# EasyEDA Pro project TC264D主板1.0.eprj, board PCB1
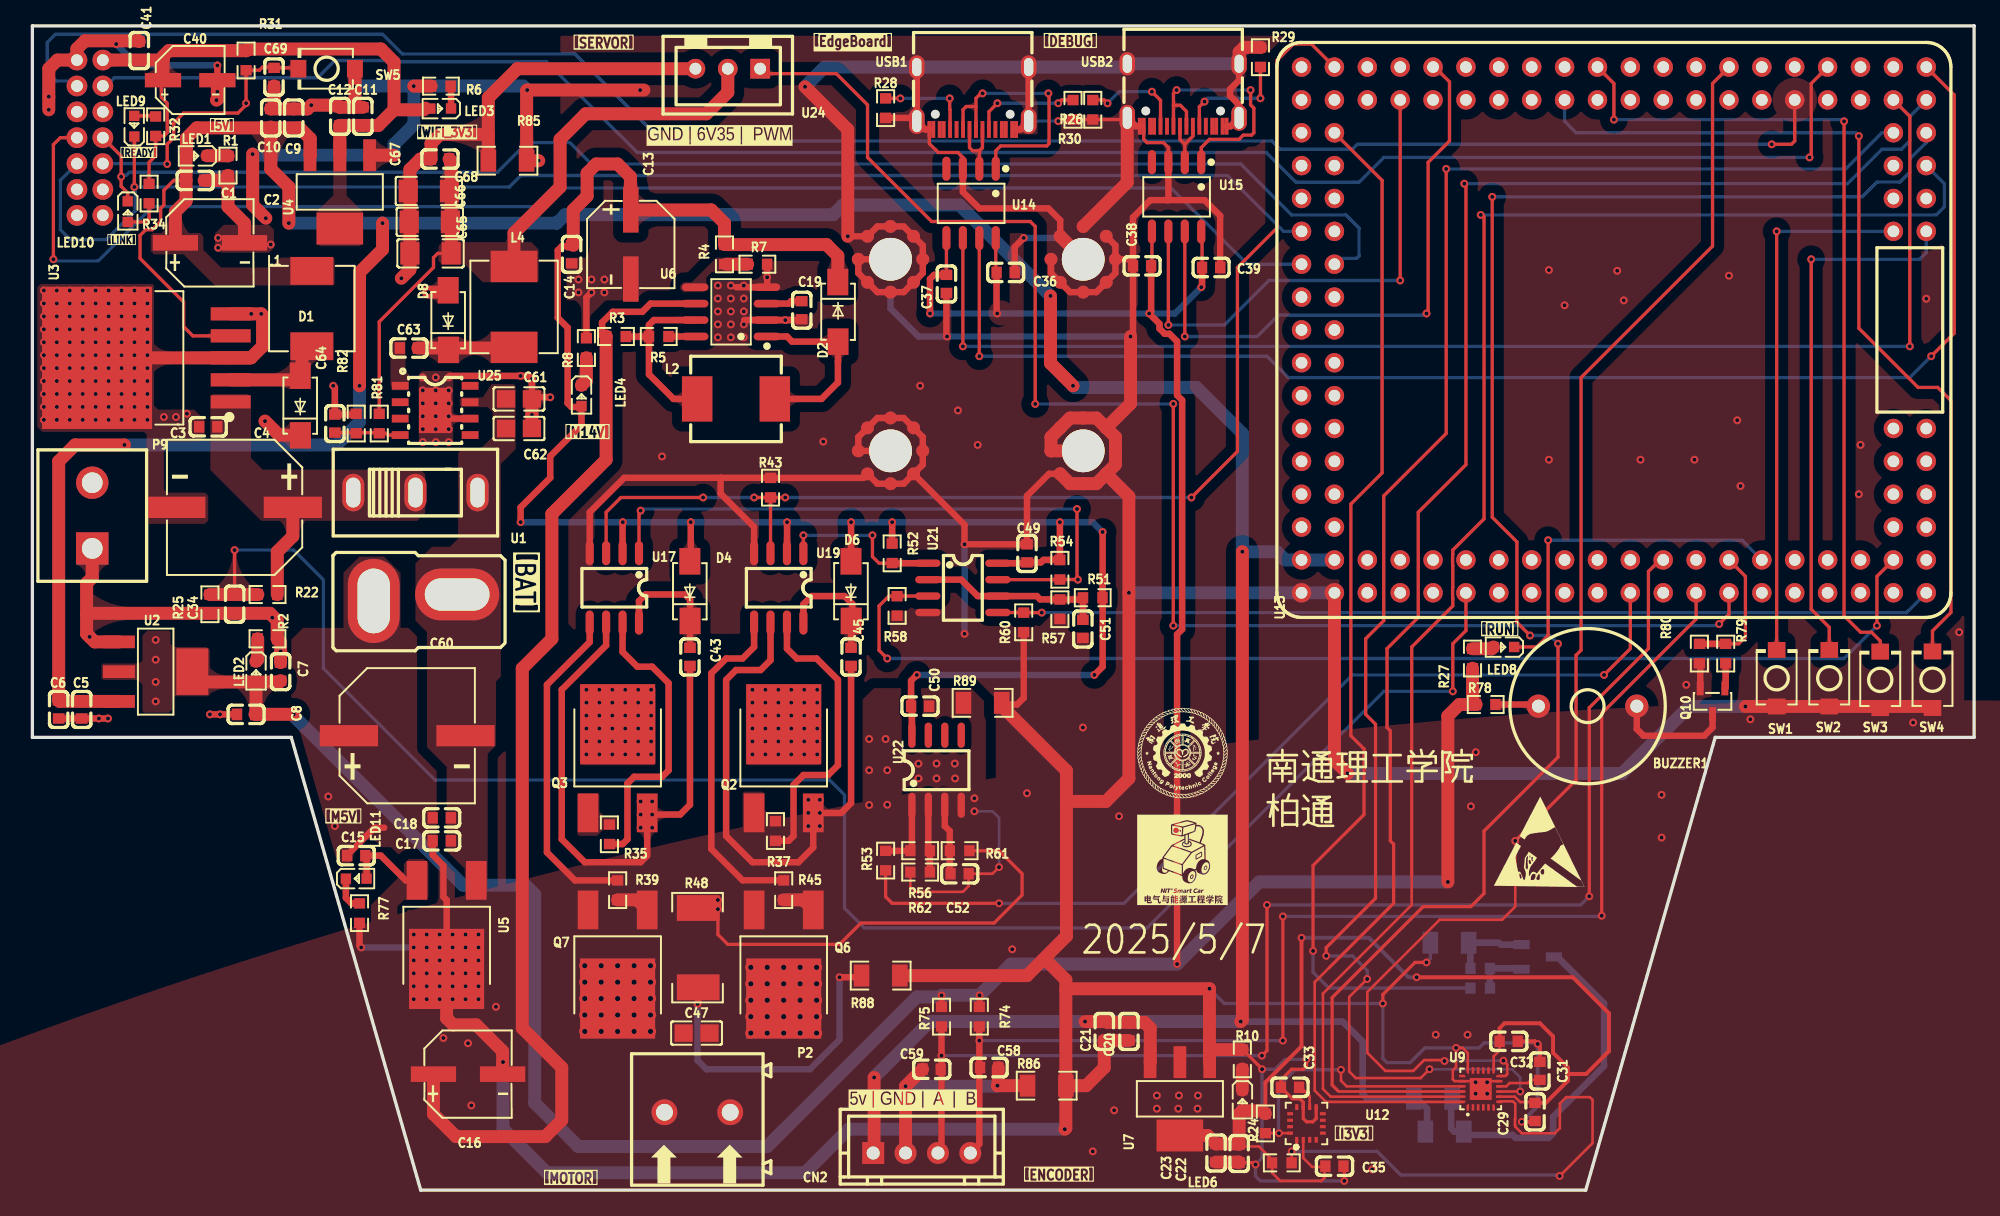
[diagram p3: board, top side]
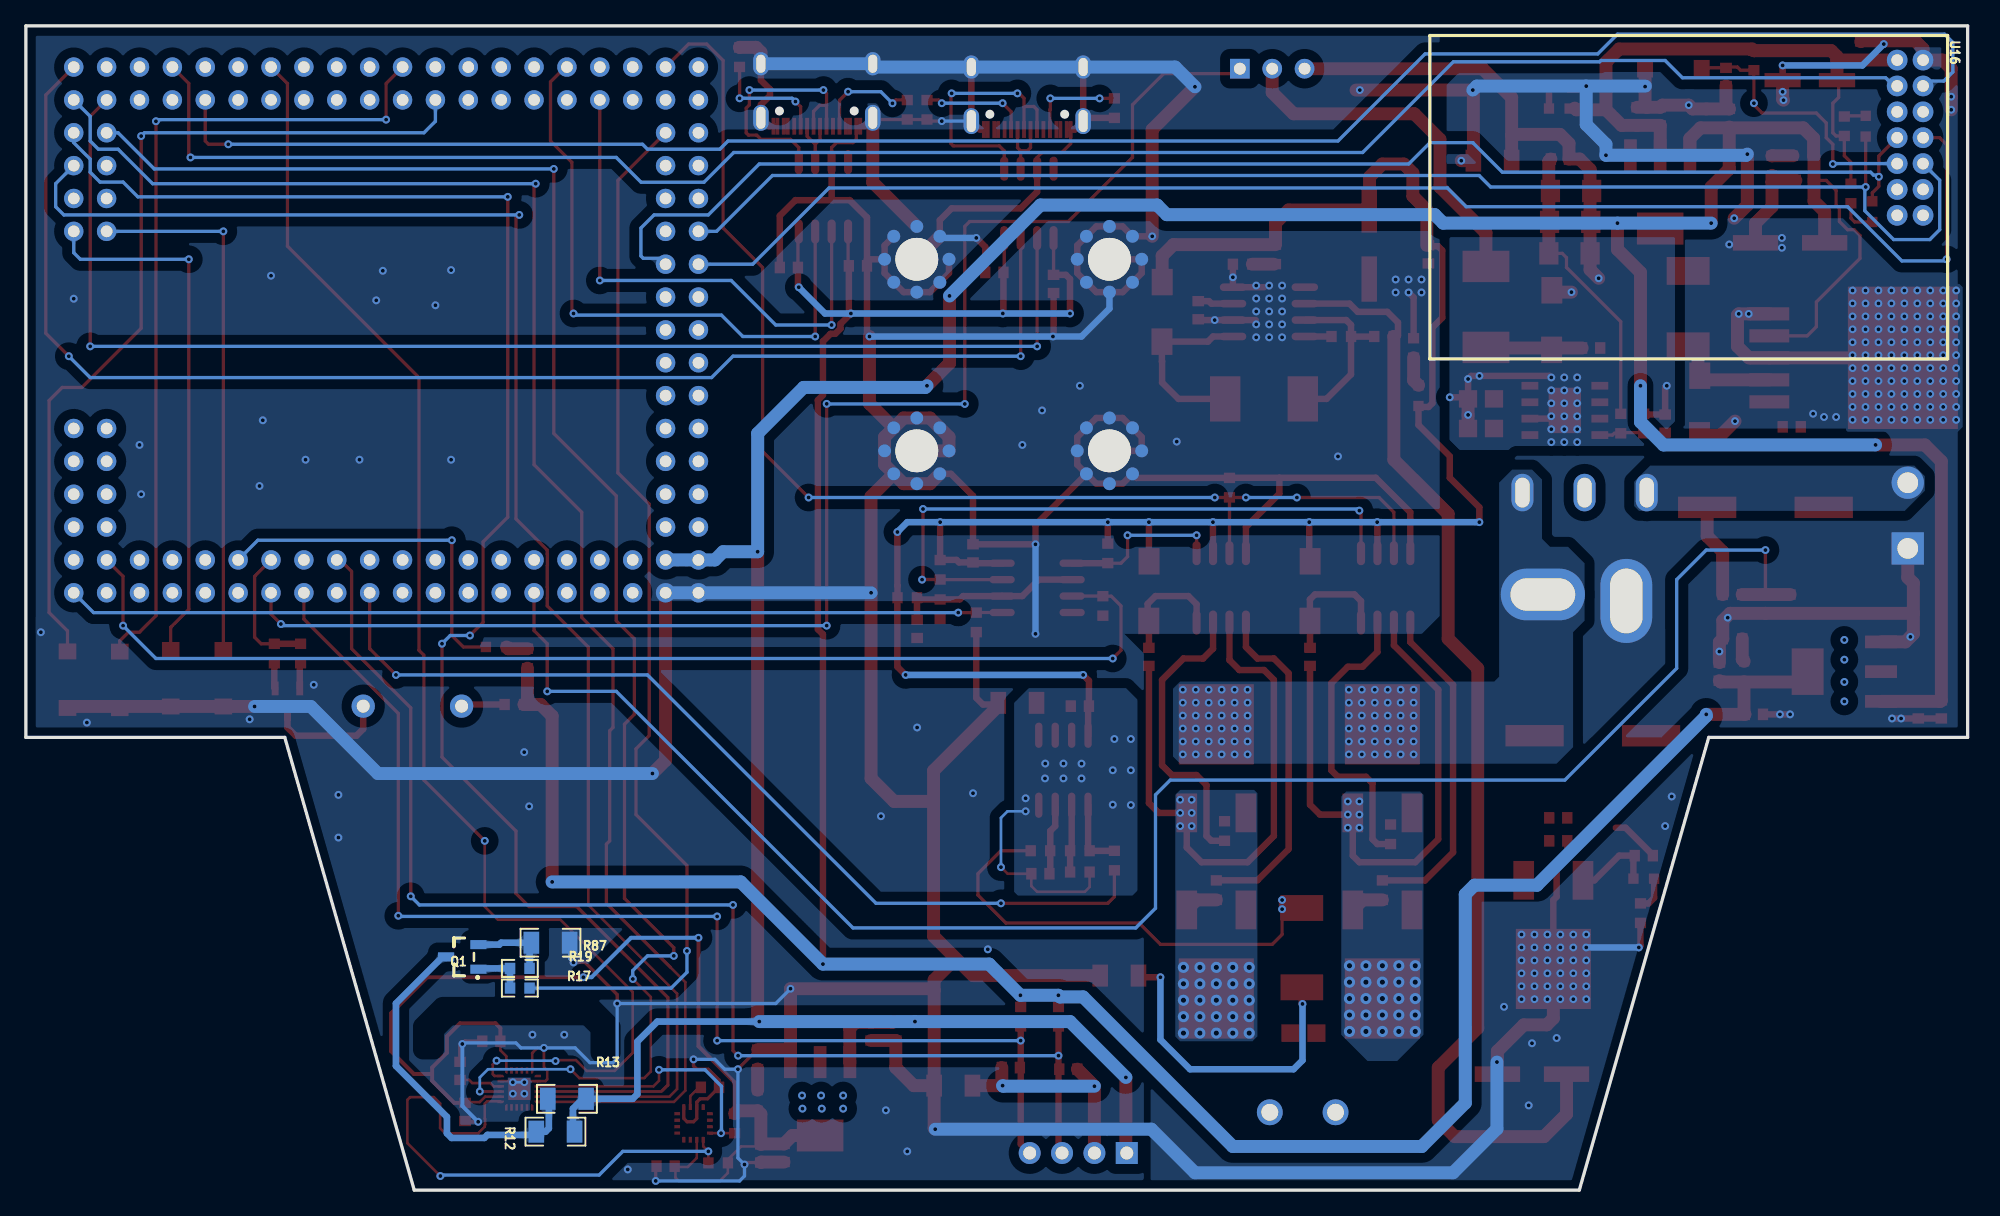
[diagram p4: board, bottom side, seen from below]

Outline 150 x 90 mm; copper layers: Top Layer, Bottom Layer. Coordinates in mm from the lower left corner of the outline.
Outline path: 0,90 0,35 20,35 30,0 120,0 130,35 150,35 150,90 0,90
Stack: Top Layer 0.035mm / Dielectric1 1.51mm FR4 er 4.5 / Bottom Layer 0.035mm

## Design rules (mm)
template: 自定义配置
spacing copperThickness1oz (default): track to track 0.102, other pairs 0.127 to 0.3
spacing copperThickness2oz: track to track 0.203, other pairs 0.152 to 0.3
track width copperThickness1oz (default): min 0.127, default 0.254, max 2.54
track width copperThickness2oz: min 0.203, default 0.254, max 2.54
differential pair differentialPair (default): width min 0.127, default 0.254, max 2.54; gap min 0.152, default 0.152
via viaSize (default): diameter min 0.5, default 0.61, max 10; hole min 0.3, default 0.305, max 6.299
net GND uses copperRegion2
net 14V uses copperRegion1
net AGND uses copperRegion1
net VCC_BAT uses copperRegion1
net SERVOR_GND uses copperRegion1

## Placement (name value [footprint] x y rotation side)
BUZZER1  2.3kHz  [BUZ-TH_BD12.0-P7.60-D0.6-FD]  120.14 37.41 0 top
C1  100nF  [C0603]  12.57 78.05 180 top
C2  220uF  [CAP-SMD_BD6.3-L6.6-W6.6-FD]  13.72 73.23 0 top
C3  100nF  [C0603]  13.59 59 0 top
C4  680uF  [CAP-SMD_BD10.0-L10.3-W10.3-LS10.9-FD]  15.62 52.78 180 top
C5  0.1u  [C0603]  3.81 37.16 90 top
C6  100uF  [C0603]  2.03 37.16 90 top
C7  0.1u  [C0603]  19.18 40.08 270 top
C8  100uF  [C0603]  16.51 36.78 0 top
C9  0.1u  [C0603]  20.19 82.88 270 top
C10  100uF  [C0603]  18.42 82.88 270 top
C11  0.1u  [C0603]  25.53 83.01 270 top
C12  100uF  [C0603]  23.75 83.01 270 top
C13  220uF/25V  [CAP-SMD_BD6.3-L6.6-W6.6-LS7.8-FD]  46.23 73.1 270 top
C14  0.1uf  [C0603]  41.66 72.34 90 top
C15  0.1uf  [C0603]  25.02 25.86 0 top
C16  220uF/25V  [CAP-SMD_BD6.3-L6.6-W6.6-LS7.8-FD]  33.66 8.97 0 top
C17  0.1uf  [C0603]  31.62 27 0 top
C18  10uf  [C0603]  31.62 28.78 0 top
C19  1nf  [C0603]  59.44 68.02 90 top
C20  0.1u  [C0603]  84.71 12.27 90 top
C21  100uF  [C0603]  82.8 12.27 90 top
C22  0.1u  [C0603]  93.22 2.83 90 top
C23  100uF  [C0603]  91.44 2.87 90 top
C29  10nf  [C0603]  116.08 6.04 270 top
C31  0.1uf  [C0603]  116.46 9.22 90 top
C32  0.1uf  [C0603]  114.05 11.5 180 top
C33  0.1uf  [C0603]  97.16 7.95 0 top
C34  0.1uf  [C0603]  15.62 45.29 270 top
C35  0.1uf  [C0603]  100.58 1.85 180 top
C36  0.1uF  [C0603]  75.18 70.94 180 top
C37  0.1uF  [C0603]  70.61 70.05 90 top
C38  0.1uF  [C0603]  85.72 71.45 0 top
C39  0.1uF  [C0603]  91.06 71.32 180 top
C40  100uF  [CAP-SMD_BD5.0-L5.3-W5.3-FD]  12.19 85.8 0 top
C41  10uf  [C0603]  8.25 88.09 270 top
C43  1NF  [C0603]  50.8 41.22 90 top
C45  1NF  [C0603]  63.25 41.22 90 top
C47  0.1uf  [C0805]  51.31 12.14 0 top
C49  0.1uf  [C0603]  76.84 49.22 90 top
C50  0.1uf  [C0603]  68.58 37.41 0 top
C51  0.1uf  [C0603]  81.15 43.38 90 top
C52  0.1uf  [C0603]  71.63 24.46 180 top
C58  68pf  [C0603]  73.91 9.47 0 top
C59  68pf  [C0603]  69.47 9.35 180 top
C60  220uF  [CAP-SMD_BD10.0-L10.3-W10.3-LS11.3-FD]  28.96 35.13 0 top
C61  10uF  [C0805]  37.59 61.16 180 top
C62  10uF  [C0805]  37.59 58.88 180 top
C63  100nF  [C0603]  29.08 65.1 180 top
C64  470pF  [C0603]  23.37 59.26 270 top
C65  47uF  [C1206]  30.76 72.41 0 top
C66  47uF  [C1206]  30.7 74.85 0 top
C67  47uF  [C1206]  30.63 77.24 0 top
C68  100nF  [C0603]  31.5 79.7 0 top
C69  100nF  [C0603]  18.67 86.05 90 top
CN1  AM-1015B-F  [CONN-TH_AM-1015B-F]  29.59 45.8 270 top
CN2  XH-4A  [CONN-TH_4P-P2.50_XH-4A]  68.71 2.87 0 top
CON1  -  [CON_M3*0.3]  66.29 71.96 0 top
CON2  -  [CON_M3*0.3]  81.18 57.15 0 top
CON3  -  [CON_M3*0.3]  81.18 71.96 0 top
CON4  -  [CON_M3*0.3]  66.29 57.15 0 top
D1  SS34  [SMA_L4.3-W2.6-LS5.0-FD]  20.7 60.65 270 top
D2  SS54  [SMA_L4.3-W2.6-LS5.0-FD]  62.23 67.89 90 top
D4  SS54  [SMA_L4.3-W2.6-LS5.0-FD]  50.8 46.3 270 top
D6  SS54  [SMA_L4.3-W2.6-LS5.0-FD]  63.25 46.3 270 top
D8  SS34  [SMA_L4.3-W2.6-LS5.0-FD]  32.13 67.26 270 top
L1  33uH  [IND-SMD_L7.1-W6.6]  21.59 68.15 270 top
L2  47uH  [IND-SMD_L7.3-W6.8]  54.36 61.16 0 top
L4  15uH  [IND-SMD_L7.0-W6.6_FXL0630]  37.21 68.27 90 top
LED1  NCD0603R1  [LED0603-RD_RED]  12.7 79.96 180 top
LED2  NCD0603R1  [LED0603-RD_RED]  17.27 40.08 270 top
LED3  NCD0603R1  [LED0603-RD_RED]  31.54 83.61 180 top
LED4  NCD0603R1  [LED0603-RD_RED]  42.42 61.42 270 top
LED6  NCD0603R1  [LED0603-RD_RED]  93.47 6.93 270 top
LED8  NCD0603R1  [LED0603-RD_RED]  113.66 41.99 180 top
LED9  NCD0603R1  [LED0603-RD_RED]  7.87 82.24 90 top
LED10  NCD0603R1  [LED0603-RD_RED]  7.37 75.64 270 top
LED11  NCD0603R1  [LED0603-RD_RED]  25.02 24.08 0 top
P2  WJ500V-5.08-2P  [CONN-TH_2P-P5.00_WJ500V-5.08-2P]  51.37 6.02 180 top
P9  XY2500V-C-5.08-2P  [CONN-TH_XY2500V-C-5.08-2P]  4.83 52.15 90 top
Q1  PMV31XN-VB  [SOT-23-3_L2.9-W1.5-P1.90-LS2.6-BR]  116.29 18.03 180 bottom
Q2  IRLR8726  [TO-252-2_L6.6-W6.1-P4.57-LS10.1-BR-CW]  58.04 32.59 270 top
Q3  IRLR8726  [TO-252-2_L6.6-W6.1-P4.57-LS10.1-BR-CW]  45.21 32.59 270 top
Q6  IRLR8726  [TO-252-2_L6.6-W6.1-P4.57-LS10.1-BR-CW]  58.04 18.24 90 top
Q7  IRLR8726  [TO-252-2_L6.6-W6.1-P4.57-LS10.1-BR-CW]  45.21 18.24 90 top
Q10  S8050  [SOT-23-3_L2.9-W1.3-P1.90-LS2.3-BR]  129.79 37.79 90 top
R1  1k  [R0603]  15.11 79.2 90 top
R2  510Ω  [R0603]  18.16 42.62 180 top
R3  1R  [R0603]  45.08 65.99 180 top
R4  12K  [R0603]  53.47 72.34 90 top
R5  200R  [R0603]  48.39 65.99 0 top
R6  510Ω  [R0603]  31.56 85.34 0 top
R7  1K  [R0603]  56.01 71.58 180 top
R8  1.5K  [R0603]  42.8 65.1 270 top
R10  510Ω  [R0603]  93.47 10.11 270 top
R12  22Ω  [R1206]  109.09 4.52 180 bottom
R13  22Ω  [R1206]  108.2 7.06 180 bottom
R17  100R  [R0603]  111.84 15.62 0 bottom
R19  10K  [R0603]  111.84 17.14 0 bottom
R22  10K  [R0603]  18.17 46.04 0 top
R23  4.7K  [R0603]  96.52 2.11 0 top
R24  4.7K  [R0603]  95.25 5.16 270 top
R25  1K  [R0603]  13.72 45.29 90 top
R26  5.1K  [R0603]  80.39 83.51 270 top
R27  510Ω  [R0603]  111.25 41.1 270 top
R28  5.1K  [R0603]  65.91 83.64 270 top
R29  5.1K  [R0603]  94.87 87.58 90 top
R30  5.1K  [R0603]  81.91 83.51 270 top
R31  4.7K  [R0603]  16.51 87.32 270 top
R32  1K  [R0603]  9.53 82.24 270 top
R34  1K  [R0603]  9.02 77.04 90 top
R35  220R  [R0603]  44.58 27.51 270 top
R37  220R  [R0603]  57.4 27.76 90 top
R39  220R  [R0603]  45.21 23.19 90 top
R43  30K  [R0603]  57.02 54.3 270 top
R45  220R  [R0603]  58.04 23.19 270 top
R48  4mΩ  [RES-SMD_L6.4-W3.2-R2512]  51.44 18.74 90 top
R51  75K  [R0603]  81.91 45.8 0 top
R52  10K  [R0603]  66.42 49.22 90 top
R53  10K  [R0603]  65.91 25.48 270 top
R54  10K  [R0603]  79.38 47.95 90 top
R56  30K  [R0603]  68.58 26.24 180 top
R57  10K  [R0603]  79.38 44.91 90 top
R58  10K  [R0603]  66.8 45.16 90 top
R60  10K  [R0603]  76.58 43.89 90 top
R61  10K  [R0603]  71.63 26.24 180 top
R62  1K  [R0603]  68.58 24.59 180 top
R74  10k  [R0603]  73.15 13.41 90 top
R75  10k  [R0603]  70.23 13.41 90 top
R77  1k  [R0603]  25.27 21.41 90 top
R78  10R  [R0603]  112.27 37.54 0 top
R79  4.7K  [R0603]  130.81 41.48 270 top
R80  10K  [R0603]  128.78 41.48 270 top
R81  42K  [R0603]  26.8 59.26 90 top
R82  10K  [R0603]  25.02 59.26 270 top
R85  0Ω  [R1206]  36.7 79.58 0 top
R86  0Ω  [R1206]  78.36 8.08 0 top
R87  0Ω  [R1206]  109.47 19.12 0 bottom
R88  0Ω  [R1206]  65.53 16.59 0 top
R89  0Ω  [R1206]  73.41 37.67 0 top
SW1  TS-1088-AR02016  [SW-SMD_L3.9-W3.0-P4.45]  134.75 39.57 90 top
SW2  TS-1088-AR02016  [SW-SMD_L3.9-W3.0-P4.45]  138.81 39.57 90 top
SW3  TS-1088-AR02016  [SW-SMD_L3.9-W3.0-P4.45]  142.75 39.45 90 top
SW4  TS-1088-AR02016  [SW-SMD_L3.9-W3.0-P4.45]  146.78 39.46 90 top
SW5  TS-1088-AR02016  [SW-SMD_L3.9-W3.0-P4.45]  22.73 86.69 180 top
U1  SS12D10G5  [SW-TH_SHOU-HAN_SS12D10G4]  29.59 53.92 0 top
U2  AMS1117-3.3  [SOT-223-4_L6.5-W3.5-P2.30-LS7.0-BR]  9.53 40.08 180 top
U3  LM2596S-5.0  [TO-263-5_L10.2-W8.9-P1.70-BR]  10.16 64.34 0 top
U4  AMS1117-3.3  [SOT-223-4_L6.5-W3.5-P2.30-LS7.0-BR]  23.75 77.16 90 top
U5  78M05  [TO-252-2_L6.6-W6.1-P4.57-LS9.9-BR-CW]  32 20.52 90 top
U6  MC34063ADR  [SOIC-8_L4.9-W3.9-P1.27-LS6.0-BL]  53.97 67.89 90 top
U7  AMS1117-3.3  [SOT-223-4_L6.5-W3.5-P2.30-LS7.0-BR]  88.65 7.06 90 top
U9  MPU-6500  [QFN-24_L3.0-W3.0-P0.40-BL-EP]  111.89 7.82 0 top
U12  QMC5883P  [LGA-16_L3.0-W3.0-P0.50-BL_SQ]  98.43 5.16 0 top
U13  -  [逐飞核心板]  121.16 66.88 90 top
U14  CH340N  [SOP-8_L4.9-W3.9-P1.27-LS6.0-BL]  72.52 76.28 180 top
U15  CH340N  [SOP-8_L4.9-W3.9-P1.27-LS6.0-BL]  88.39 76.78 180 top
U16  USR-WIFI232-B2  [COMM-TH_USR-WIFI232-B2]  4.44 81.36 0 bottom
U17  L6384ED013TR  [SOP-8_L4.9-W3.9-P1.27-LS6.0-BL]  44.96 46.56 180 top
U19  L6384ED013TR  [SOP-8_L4.9-W3.9-P1.27-LS6.0-BL]  57.66 46.56 180 top
U21  LM393DR  [SOIC-8_L5.0-W4.0-P1.27-LS6.0-BL]  71.88 46.56 270 top
U22  LM258DR  [SOIC-8_L5.0-W4.0-P1.27-LS6.0-BL]  69.85 32.46 0 top
U24  BX-XH2.54-3PZZ  [CONN-TH_3P-P2.50_BX-XH2.54-3PZZ]  53.72 86.69 180 top
U25  TPS5430DDAR  [ESOP-8_L4.9-W3.9-P1.27-LS6.0-TL-EP]  31.11 60.27 0 top
USB1  KH-TYPE-C-16P  [USB-C-SMD_KH-TYPE-C-16P]  72.64 84.4 180 top
USB2  KH-TYPE-C-16P  [USB-C-SMD_KH-TYPE-C-16P]  88.9 84.66 180 top

## Footprints (pads in the part's own frame, mm; a bottom-side part is the same pattern mirrored in y, then rotated)
BUZ-TH_BD12.0-P7.60-D0.6-FD
  round 1.8 hole 1: 1(-3.8,0) 2(3.8,0)
C0603
  rect 0.8x0.9 smd: 1(-0.7,0) 2(0.7,0)
C0805
  rect 1.41x1.35 smd: 1(-1,0) 2(1,0)
C1206
  rect 1.485x1.728 smd: 1(-1.593,0) 2(1.593,0)
CAP-SMD_BD5.0-L5.3-W5.3-FD
  rect 2.8x1.1 smd: 1(-2.1,0) 2(2.1,0)
CAP-SMD_BD6.3-L6.6-W6.6-FD
  rect 3.5x1.2 smd: 1(-2.67,0) 2(2.67,0)
CAP-SMD_BD6.3-L6.6-W6.6-LS7.8-FD
  rect 3.5x1.2 smd: 1(-2.67,0) 2(2.67,0)
CAP-SMD_BD10.0-L10.3-W10.3-LS10.9-FD
  rect 4.5x1.65 smd: 1(-4.5,0) 2(4.5,0)
CAP-SMD_BD10.0-L10.3-W10.3-LS11.3-FD
  rect 4.5x1.65 smd: 1(-4.5,0) 2(4.5,0)
COMM-TH_USR-WIFI232-B2
  round 1.6 hole 0.9: 1(-1,-6) 2(1,-6) 3(-1,-4) 4(1,-4) 5(-1,-2) 6(1,-2) 7(-1,0) 8(1,0) 9(-1,2) 10(1,2) 11(-1,4) 12(1,4) 13(-1,6) 14(1,6)
CON_M3*0.3
  round 1 hole 0.003: 1(-2.489,0) 1(-1.778,1.778) 1(-1.778,-1.778) 1(0,2.54) 1(0,-2.54) 1(1.778,1.778) 1(1.778,-1.778) 1(2.489,0)
  round 3.3 hole 3.3: 1(0,0)
CONN-TH_2P-P5.00_WJ500V-5.08-2P
  round 2 hole 1.3: 1(-2.54,0) 2(2.54,0)
CONN-TH_3P-P2.50_BX-XH2.54-3PZZ
  rect 1.524x1.524 hole 0.914: 1(-2.5,0)
  round 1.524 hole 0.914: 2(0,0) 3(2.5,0)
CONN-TH_4P-P2.50_XH-4A
  rect 1.7x1.7 hole 1: 1(-3.751,0)
  round 1.7 hole 1: 2(-1.25,0) 3(1.25,0) 4(3.751,0)
CONN-TH_AM-1015B-F
  oval 4x6.5 hole 2.5x5: 1(-0.25,3.224)
  oval 6.5x4 hole 5x2.5: 2(0.25,-3.224)
CONN-TH_XY2500V-C-5.08-2P
  rect 2.5x2.5 hole 1.6: 1(-2.54,0.2)
  round 2.5 hole 1.6: 2(2.54,0.2)
ESOP-8_L4.9-W3.9-P1.27-LS6.0-TL-EP
  rect 1.3x0.6 smd: 1(-2.7,1.905) 2(-2.7,0.635) 3(-2.7,-0.635) 4(-2.7,-1.905) 5(2.7,-1.905) 6(2.7,-0.635) 7(2.7,0.635) 8(2.7,1.905)
  rect 2.5x3.5 smd: 9(0,0)
IND-SMD_L7.0-W6.6_FXL0630
  rect 2.424x3.62 smd: 1(3.128,0) 2(-3.128,0)
IND-SMD_L7.1-W6.6
  rect 2.15x3.32 smd: 1(-2.913,0) 2(2.913,0)
IND-SMD_L7.3-W6.8
  rect 2.35x3.5 smd: 1(-3,0) 2(3,0)
LED0603-RD_RED
  rect 0.8x0.8 smd: 1(-0.799,-0.004) 2(0.799,0.004)
LGA-16_L3.0-W3.0-P0.50-BL_SQ
  rect 0.25x0.45 smd: 1(-0.75,-1.263) 2(-0.25,-1.263) 3(0.25,-1.263) 4(0.75,-1.263) 9(0.75,1.263) 10(0.25,1.263) 11(-0.25,1.263) 12(-0.75,1.263)
  rect 0.45x0.25 smd: 5(1.263,-0.75) 6(1.263,-0.25) 7(1.263,0.25) 8(1.263,0.75) 13(-1.263,0.75) 14(-1.263,0.25) 15(-1.263,-0.25) 16(-1.263,-0.75)
QFN-24_L3.0-W3.0-P0.40-BL-EP
  custom 0.2x0.506 smd: 1(-1,-1.427) 6(1,-1.427) 13(1,1.427) 18(-1,1.427)
  rect 0.2x0.505 smd: 2(-0.6,-1.427) 3(-0.2,-1.427) 4(0.2,-1.427) 5(0.6,-1.427) 14(0.6,1.427) 15(0.2,1.427) 16(-0.2,1.427) 17(-0.6,1.427)
  custom 0.506x0.2 smd: 7(1.427,-1) 12(1.427,1) 19(-1.427,1) 24(-1.427,-1)
  rect 0.505x0.2 smd: 8(1.427,-0.6) 9(1.427,-0.2) 10(1.427,0.2) 11(1.427,0.6) 20(-1.427,0.6) 21(-1.427,0.2) 22(-1.427,-0.2) 23(-1.427,-0.6)
  rect 1.7x1.7 smd: 25(0,0)
R0603
  rect 0.806x0.864 smd: 1(-0.753,0) 2(0.753,0)
R1206
  rect 1.208x1.701 smd: 1(-1.479,0) 2(1.479,0)
RES-SMD_L6.4-W3.2-R2512
  rect 2x3.3 smd: 1(-3.067,0) 2(3.067,0)
SMA_L4.3-W2.6-LS5.0-FD
  rect 2.046x1.62 smd: 1(-2.304,-0.009) 2(2.304,0.009)
SOIC-8_L4.9-W3.9-P1.27-LS6.0-BL
  oval 0.588x2.045 smd: 1(-1.905,-2.772) 2(-0.635,-2.772) 3(0.635,-2.772) 4(1.905,-2.772) 5(1.905,2.772) 6(0.635,2.772) 7(-0.635,2.772) 8(-1.905,2.772)
SOIC-8_L5.0-W4.0-P1.27-LS6.0-BL
  oval 0.569x1.95 smd: 1(-1.905,-2.705) 2(-0.635,-2.705) 3(0.635,-2.705) 4(1.905,-2.705) 5(1.905,2.705) 6(0.635,2.705) 7(-0.635,2.705) 8(-1.905,2.705)
SOP-8_L4.9-W3.9-P1.27-LS6.0-BL
  oval 0.63x1.865 smd: 1(-1.905,-2.683) 2(-0.635,-2.683) 3(0.635,-2.683) 4(1.905,-2.683) 5(1.905,2.683) 6(0.635,2.683) 7(-0.635,2.683) 8(-1.905,2.683)
SOT-23-3_L2.9-W1.3-P1.90-LS2.3-BR
  rect 1.07x0.532 smd: 1(0.99,-0.95) 2(0.99,0.95) 3(-0.99,0)
SOT-23-3_L2.9-W1.5-P1.90-LS2.6-BR
  rect 1.25x0.7 smd: 1(1.25,-0.95) 2(1.25,0.95) 3(-1.25,0)
SOT-223-4_L6.5-W3.5-P2.30-LS7.0-BR
  rect 2.47x0.98 smd: 1(2.835,-2.3) 2(2.835,0) 3(2.835,2.3)
  rect 2.47x3.6 smd: 4(-2.835,0)
SW-SMD_L3.9-W3.0-P4.45
  rect 1.23x1.36 smd: 1(-2.185,0) 2(2.185,0)
SW-TH_SHOU-HAN_SS12D10G4
  oval 1.7x2.9 hole 1.1x2.3: 1(-4.8,0) 2(0,0) 3(4.8,0)
TO-252-2_L6.6-W6.1-P4.57-LS9.9-BR-CW
  rect 3x1.6 smd: 1(3.424,-2.29) 3(3.424,2.29)
  rect 6.2x5.8 smd: 2(-3.424,0)
TO-252-2_L6.6-W6.1-P4.57-LS10.1-BR-CW
  rect 3x1.6 smd: 1(3.423,-2.285) 3(3.424,2.285)
  rect 6.2x5.8 smd: 2(-3.424,0)
TO-263-5_L10.2-W8.9-P1.70-BR
  rect 3.083x1.02 smd: 1(5.16,-3.4) 2(5.16,-1.7) 3(5.16,0) 4(5.16,1.7) 5(5.16,3.4)
  rect 8.5x11 smd: 6(-5.16,0)
USB-C-SMD_KH-TYPE-C-16P
  oval 1.2x2 hole 0.7x1.7: 1(-4.32,1.765) 2(4.32,1.765)
  oval 1.2x1.8 hole 0.7x1.4: 3(-4.32,-2.415) 4(4.32,-2.415)
  rect 0.3x1.3 smd: A1(-3.35,2.415) A4(-2.55,2.415) A5(-1.25,2.415) A6(-0.25,2.415) A7(0.25,2.415) A8(1.25,2.415) A9(2.55,2.415) A12(3.35,2.415) B1(3.05,2.415) B4(2.25,2.415) B5(1.75,2.415) B6(0.75,2.415) B7(-0.75,2.415) B8(-1.75,2.415) B9(-2.25,2.415) B12(-3.05,2.415)
逐飞核心板
  round 1.5 hole 0.9: 1(-20.701,23.114) 2(-18.161,23.114) 3(-20.701,20.574) 4(-18.161,20.574) 5(-20.701,18.034) 6(-18.161,18.034) 7(-20.701,15.494) 8(-18.161,15.494) 9(-20.701,12.954) 10(-18.161,12.954) 11(-20.701,10.414) 12(-18.161,10.414) 13(-20.701,7.874) 14(-18.161,7.874) 15(-20.701,5.334) 16(-18.161,5.334) 17(-20.701,2.794) 18(-18.161,2.794) 19(-20.701,0.254) 20(-18.161,0.254) 21(-20.701,-2.286) 22(-18.161,-2.286) 23(-20.701,-4.826) 24(-18.161,-4.826) 25(-20.701,-7.366) 26(-18.161,-7.366) 27(-20.701,-9.906) 28(-18.161,-9.906) 29(-20.701,-12.446) 30(-18.161,-12.446) 31(-20.701,-14.986) 32(-18.161,-14.986) 33(-20.701,-17.526) 34(-18.161,-17.526) 35(-20.701,-20.066) 36(-18.161,-20.066) 37(-20.701,-22.606) 38(-18.161,-22.606) 39(-20.701,-25.146) 40(-18.161,-25.146) 41(-15.621,-25.146) 42(-15.621,-22.606) 43(-13.081,-25.146) 44(-13.081,-22.606) 45(-10.541,-25.146) 46(-10.541,-22.606) 47(-8.001,-25.146) 48(-8.001,-22.606) 49(7.239,-22.606) 50(7.239,-25.146) 51(9.779,-22.606) 52(9.779,-25.146) 53(12.319,-22.606) 54(12.319,-25.146) 55(14.859,-22.606) 56(14.859,-25.146) 57(17.399,-25.146) 58(19.939,-25.146) 59(17.399,-22.606) 60(19.939,-22.606) 61(17.399,-20.066) 62(19.939,-20.066) 63(17.399,-17.526) 64(19.939,-17.526) 65(17.399,-14.986) 66(19.939,-14.986) 67(17.399,-12.446) 68(19.939,-12.446) 69(17.399,-9.906) 70(19.939,-9.906) 71(17.399,-7.366) 72(19.939,-7.366) 73(17.399,-4.826) 74(19.939,-4.826) 75(17.399,-2.286) 76(19.939,-2.286) 77(17.399,0.254) 78(19.939,0.254) 79(17.399,2.794) 80(19.939,2.794) 81(17.399,5.334) 82(19.939,5.334) 83(17.399,7.874) 84(19.939,7.874) 85(17.399,10.414) 86(19.939,10.414) 87(17.399,12.954) 88(19.939,12.954) 89(17.399,15.494) 90(19.939,15.494) 91(17.399,18.034) 92(19.939,18.034) 93(17.399,20.574) 94(19.939,20.574) 95(17.399,23.114) 96(19.939,23.114) 97(14.859,20.574) 98(14.859,23.114) 99(12.319,20.574) 100(12.319,23.114) 101(9.779,20.574) 102(9.779,23.114) 103(7.239,20.574) 104(7.239,23.114) 105(4.699,20.574) 106(4.699,23.114) 107(2.159,20.574) 108(2.159,23.114) 109(-0.381,20.574) 110(-0.381,23.114) 111(-2.921,20.574) 112(-2.921,23.114) 113(-5.461,20.574) 114(-5.461,23.114) 115(-8.001,20.574) 116(-8.001,23.114) 117(-10.541,20.574) 118(-10.541,23.114) 119(-13.081,20.574) 120(-13.081,23.114) 121(-15.621,20.574) 122(-15.621,23.114)

## Nets
As in the schematic.

Pads without a net: U9 1 2 3 4 5 6 14 15 16 17 19; U12 3 4 5 6 7 8 12 13 14 15; U13 5 6 7 8 9 10 12 13 14 15 16 17 18 19 22 23 26 29 31 32 33 34 35 36 37 42 43 44 45 46 47 48 51 52 53 60 61 62 63 66 67 68 69 71 72 73 74 77 80 81 82 83 84 86 92 93 96 98 99 100 101 102 103 107 108 109 110 111 112 113 114 115 116 117 118 119 120 121 122; U14 4; U15 4; U16 5 6 11 12 13 14; U25 2 3 5 8; USB1 A4 A8 A9 B4 B8 B9; USB2 A4 A8 A9 B4 B8 B9

## Via types
v1: diameter 0.61, hole 0.305, Top Layer to Bottom Layer, 508 vias
v2: diameter 0.864, hole 0.406, Top Layer to Bottom Layer, 50 vias

## Routing (per net, layer and track width the routed paths; a pad name or vN(x,y) marks a point on that pad's centre or on a via; arc(x,y) is an arc through that point)
3.3V: length 248.8
  Top Layer w0.254: 70.61,73.21 C37.2 ; 74.42,73.21 74.42,71 C36.2 ; C38.2 86.49,71.51 86.49,73.47 ; C39.2 90.36,73.4 90.3,73.47
  Top Layer w0.5: v1(88.43,17.47) 88.43,42.96 88.82,43.35 88.82,61.06 88.43,61.46 88.43,65.61 87.84,66.2 87.47,66.2 87.07,66.59 87.07,66.96 v1(86.27,67.77) 86.43,67.92 C38.2 ; R75.2 70.24,14.17 v1(70.24,15.06) ; C36.2 74.48,67.81 v1(74.53,67.77) ; R74.2 73.17,14.19 v1(73.17,15.06) ; C37.2 69.66,70.75 69.34,70.43 v1(69.34,67.77) ; v1(90.3,69.8) 90.36,69.86 C39.2
  Top Layer w1: LED2.2 17.28,36.84 C8.2 v1(20.19,36.78) ; LED2.2 19.08,39.28 C7.2 ; LED2.2 13.16,39.28 U2.4 ; v1(109.35,23.82) 109.35,36.65 110.24,37.54 R78.1 111.25,37.8 R27.2
  Bottom Layer w0.5: v1(69.34,67.77) v1(74.53,67.77) v1(86.27,67.77) 88.26,67.77 v1(90.3,69.8)
  Bottom Layer w1: v1(109.35,23.82) 94.78,23.82 v1(88.43,17.47) 75.59,17.47 v1(73.17,15.06) v1(70.24,15.06) 70.11,14.93 68.33,14.93 56.77,3.38 42.16,3.38 38.81,6.73 38.81,22.86 38.1,23.57 33.27,23.57 20.19,36.65 v1(20.19,36.78)
  vias: v1(9.53,42.53) v1(9.53,41) v1(9.53,39.28) v1(9.53,37.78)
5V: length 313.5
  Top Layer w0.254: C1.2 10.92,78.05 10.16,77.29 10.16,76.15 9.91,75.89 9.91,74.88 9.27,74.24 8.76,74.24 8.32,73.8 8.32,72.02 11.68,68.66 11.68,66.75 12.4,66.04 U3.4
  Top Layer w1: 21.45,80 21.46,80.01 21.46,81.29 20.64,82.12 18.42,82.12 ; 18.42,82.12 12.7,82.12 11.9,81.32 LED1.2 11.87,79.93 C1.2 11.87,76.46 11.05,75.64 C2.1 ; 18.42,82.12 18.42,78.94 19.81,77.55 v1(19.81,74.75) ; 18.42,82.12 C10.2 ; v1(81.32,13.03) 83,13.03 83.06,12.97 85.91,12.97 86.36,12.52 86.36,9.91 U7.3 ; CN2.1 65.02,2.94 v1(65.02,8.71) ; C6.2 2.03,56.34 3.3,57.61 v1(7.11,57.61) ; v1(93.47,49.35) 93.47,13.16 v1(93.34,13.03) ; v1(25.27,62.18) 25.27,70.94 27.05,72.72 v1(27.05,74.75) ; v1(78.65,69.13) 78.65,63.92 v1(80.39,62.18) ; U2.3 2.11,37.78 2.03,37.86
  Bottom Layer w0.508: R12.2 107.74,4.65 107.74,6.3 106.98,7.06 R13.2 103.12,7.06 102.76,7.42 102.76,11.48 101.22,13.03 v1(93.34,13.03)
  Bottom Layer w1: v1(65.02,8.71) 69.34,13.03 v1(81.32,13.03) v1(93.34,13.03) ; U13.4 U13.2 96.77,48.72 96.14,49.35 v1(93.47,49.35) 93.47,58.5 89.92,62.05 80.52,62.05 v1(80.39,62.18) ; v1(7.11,57.61) 23.5,57.61 25.27,59.38 v1(25.27,62.18) ; v1(78.65,69.13) 71.63,76.15 62.61,76.15 61.87,75.41 41.17,75.41 40.51,74.75 v1(27.05,74.75) v1(19.81,74.75)
12V: length 7.2
  Top Layer w1: C4.1 20.12,50.55 18.92,49.35 R22.2
14V: length 154.1
  Top Layer w0.5: v1(45.61,51.64) 45.59,51.62 U17.2 ; U22.8 67.94,37.35 C50.1 67.88,39.38 v1(68.33,39.83) ; v1(66.42,51.64) 66.42,50.1 ; v1(50.86,51.64) 50.86,48.68 D4.1 ; v1(82.68,50.88) 82.68,46.74 82.67,46.73 R51.2 82.68,45.79 82.68,40.46 v1(82.04,39.83) ; v1(58.3,51.64) 58.3,49.25 U19.2 ; v1(63.25,51.64) 63.25,48.62 D6.1 ; v1(79.38,51.64) R54.2 79.37,48.72 78.1,48.72 77.91,48.52 C49.1 76.77,48.46 U21.8 ; 41.78,73.04 41.71,72.96 40.91,72.96 40.59,72.65 40.59,67.44 41.35,66.68 41.35,60.83 41.64,60.54 42.35,60.54 LED4.2 42.42,59.15 40,56.73 40,55.07 37.72,52.78 v1(37.72,51.64)
  Top Layer w1: 53.47,73.22 53.47,74.75 52.45,75.77 C13.1 46.2,75.79 46.2,78.32 45.2,79.32 43.56,79.32 42.85,78.62 42.85,76.84 41.78,75.77 41.78,73.04 ; D2.2 62.22,72.22 61.35,73.09 R4.2
  Bottom Layer w0.5: v1(82.68,50.88) 81.91,51.64 v1(79.38,51.64) v1(66.42,51.64) v1(63.25,51.64) v1(58.3,51.64) v1(50.86,51.64) v1(45.61,51.64) v1(37.72,51.64) ; v1(68.33,39.83) v1(82.04,39.83)
AGND: length 15.4
  Top Layer w0.203: v1(74.68,24.97) 74.17,24.46 C52.1 72.33,23.51 71.88,23.06 68.2,23.06 67.83,23.43 R62.2
  Bottom Layer w0.203: v1(72.77,29.29) 74.17,29.29 74.68,28.78 v1(74.68,24.97)
  vias: v1(64.64,34.87) v1(64.64,32.46) v1(64.64,29.77) v1(65.91,34.87) v1(66.04,32.46) v1(66.04,29.79) v1(68.45,32.97) v1(68.45,31.83) v1(69.85,32.98) v1(69.85,31.83) v1(71.26,32.98) v1(71.28,31.83) v1(72.77,30.29)
GND: length 827
  Top Layer w0.203: U9.18 110.89,10.6 110.49,11 v1(109.98,11) 109.98,9.51 109.73,9.26 109.73,8.57 109.87,8.42 U9.20 111.41,8.42 v1(111.5,8.34) ; U9.25 111.89,7.84 v1(112.38,8.34) 112.47,8.42 U9.11
  Top Layer w0.254: U15.3 87.76,80.59 87.38,80.97 86.11,80.97 85.85,81.23 USB2.B1 ; 80.52,82.63 80.51,82.64 v1(79.25,82.64) ; R26.2 R30.2 84.45,82.76 USB2.2 ; v1(98.43,10.11) 98.43,9.6 98.17,9.35 97.28,9.35 96.46,8.52 C33.1 97.34,7.06 97.92,7.06 98.18,6.8 U12.11 98.18,5.54 98.43,5.28 98.92,5.28 99.18,5.54 U12.9 ; USB1.A12 69.29,80.9 69.98,80.21 71.5,80.21 71.88,79.83 U14.3 ; C35.1 101.35,1.79 v1(101.35,0.71) ; v1(95,9.35) 95,9.37 93.5,10.86 ; v1(104.33,14.43) 104.33,15.12 106.81,17.6 v1(107.7,17.6) ; v1(94.49,1.98) 94.34,2.13 C22.1
  Top Layer w0.305: C29.2 116.02,5.28 v1(115.06,5.28) ; 116.46,9.92 116.46,11.12 116.08,11.5 C32.1
  Top Layer w0.5: CON3.1 83.67,73.02 CON3.1 ; USB2.A1 92.57,82.24 USB2.1 93.22,83.9 92.52,84.6 92.52,85.1 93.22,85.8 USB2.3 ; 87.69,76.53 90.55,76.53 91.76,75.32 C39.1 ; 87.69,76.53 87.76,76.59 U15.3 ; 87.69,76.53 86.36,76.53 85.03,75.19 85.03,71.96 ; R77.1 25.27,18.89 v1(25.4,18.76) ; 53.17,55.07 57.01,55.07 R43.1 64.2,55.06 64.52,55.37 65.28,54.61 CON4.1 67.31,54.61 68.07,55.37 ; 53.17,55.07 53.17,53.84 55.75,51.26 U19.4 ; 53.17,55.07 45.72,55.07 43.05,52.4 U17.4 ; USB2.A12 85.23,82.24 USB2.2 ; Q10.2 128.84,40.66 R80.2 ; CON3.1 85.02,71.96 85.03,71.96 ; CON3.1 83.67,70.89 CON3.1 82.19,69.42 CON3.1 80.16,69.42 CON3.1 78.69,70.89 78.69,71.96 ; v1(43.19,69.39) 42.8,69 R8.1 ; 68.07,55.37 68.78,56.08 CON4.1 68.78,58.22 CON4.1 67.31,59.69 CON4.1 65.28,59.69 CON4.1 63.81,58.22 CON4.1 CON4.1 ; 68.07,55.37 72.01,51.43 v1(72.01,49.92) C49.2 76.84,53.67 78.54,55.37 79.4,55.37 ; v1(84.84,65.99) 85.03,66.18 C38.1 85.03,71.96 ; C36.1 75.88,72.91 v1(76.58,73.61) ; C17.1 30.92,25.92 31.75,25.09 31.75,22.68 32,22.43 U5.2 ; C37.1 70.61,65.99 ; v1(5.84,36.46) v1(5.14,36.46) C5.1 C6.1 ; USB1.2 68.07,82.89 65.79,82.89 ; USB1.2 68.97,81.99 USB1.A12 ; USB1.2 USB1.4 ; USB1.A1 76.31,81.99 USB1.1 USB1.3 ; R7.1 v1(56.76,70.57) 56.76,69.81 U6.4 54.36,69.8 ; C19.1 59.37,67.26 v1(58.17,67.26) U6.2 54.99,67.26 ; v1(62.99,73.74) CON1.1 65.28,74.5 CON1.1 67.31,74.5 CON1.1 68.78,73.02 CON1.1 68.78,70.89 CON1.1 67.31,69.42 CON1.1 65.28,69.42 CON1.1 63.81,70.89 CON1.1 CON1.1 ; C15.1 24.32,25.91 26.43,28.02 27.18,28.02 ; C40.2 v1(14.29,86.94) ; R60.1 76.58,38.05 76.07,37.54 75.01,37.54 ; U14.3 71.88,77.16 73.15,75.89 78.49,75.89 79.4,74.98 CON3.1 ; v1(13.72,36.78) v1(14.5,36.78) C8.1
  Top Layer w1: v1(101.6,32.21) 100.58,33.22 U13.3 ; 4.19,44.59 4.19,43 v1(4.42,42.77) 4.81,42.38 U2.1 ; 4.19,44.59 4.19,46.92 4.63,47.36 P9.1 ; 4.19,44.59 C34.2 18.35,44.59 18.91,44.03 R2.1 19.18,42.36 v1(19.18,41.64) C7.1 ; R29.2 94.86,88.34 93.6,88.34 93.22,87.96 USB2.3 ; C1.1 14.98,78.05 15.11,77.92 ; USB2.2 84.58,77.9 CON3.1 ; 79.84,15.45 79.95,15.57 v1(90.93,15.57) 90.93,11.18 ; 79.84,15.45 R86.2 ; 79.84,15.45 79.84,16.25 78.36,17.73 ; 26.05,80 v1(27.94,80) ; 15.11,77.92 R1.1 ; 15.11,77.92 15.11,76.02 16.39,74.75 C2.2 ; CON2.1 84.84,60.81 v1(84.84,65.99) ; CON2.1 82.19,59.69 CON2.1 80.16,59.69 CON2.1 78.69,58.22 78.69,57.15 CON2.1 ; CON2.1 83.67,58.22 CON2.1 83.67,56.08 82.96,55.37 ; U3.5 v1(16.91,67.74) v1(17.68,67.74) 17.78,67.64 17.78,65.23 16.89,64.34 U3.3 U3.6 ; v1(79.76,4.71) 79.84,4.79 R86.2 ; C20.1 C21.1 82.8,9.47 81.41,8.08 R86.2 ; 82.96,55.37 82.19,54.61 CON2.1 80.16,54.61 79.4,55.37 ; 82.96,55.37 84.71,53.62 v1(84.71,46.18) 84.71,31.83 82.93,30.05 80.08,30.05 79.88,29.85 ; 74.88,37.67 74.88,37.42 79.88,32.42 79.88,29.85 ; 90.93,11.18 90.93,9.91 U7.1 ; 90.93,11.18 91.25,10.86 R10.1 ; v1(1.27,83.51) v1(1.27,84.53) 1.27,86.69 1.94,87.36 U16.1 3.44,88.23 4.06,88.85 8.19,88.85 C41.1 ; 24.79,83.71 C11.1 ; 24.79,83.71 24.92,83.84 v1(24.92,85.31) SW5.1 ; 24.79,83.71 C12.1 23.58,83.87 v1(21.55,83.87) 21.25,83.58 C9.1 C10.1 18.67,83.83 C69.1 ; v1(14.22,84.26) 14.29,84.33 v1(14.29,84.9) C40.2 ; D1.2 20.69,58.37 19.05,58.37 v1(17.97,59.45) ; R88.2 76.84,16.59 79.88,19.63 79.88,29.85 ; C23.1 93.19,2.17 C22.1 ; 30.81,85.34 v1(29.46,85.34) ; SW4.1 146.67,37.39 SW2.1 SW1.1 v1(132.33,37.39) ; U5.2 32,13.28 32.51,12.78 34.29,12.78 36.33,10.74 C16.2 ; v1(17.02,80.09) 17.02,76.15 v1(18.03,75.13) ; 47.24,85.04 v1(38.23,85.04) 38.18,84.99 R85.2 v1(39.12,79.58) ; CON3.1 CON3.1 ; v1(62.99,73.74) 62.99,81.99 v1(59.69,85.29)
  Bottom Layer w0.203: v1(112.38,8.34) v1(111.5,8.34)
  Bottom Layer w0.254: USB1.1 v1(79.25,82.64) ; v1(101.35,0.71) 94.87,0.71 94.49,1.09 v1(94.49,1.98) 95,2.49 v1(95,9.35) 96.01,9.35 96.77,10.11 v1(98.43,10.11) ; 108,19.12 108,17.9 v1(107.7,17.6) ; v1(90.93,15.57) 92.07,14.43 v1(104.33,14.43) 104.33,10.18 104.65,9.85 106.43,9.85 107.57,11 v1(109.98,11) 111.76,11 112.14,11.38 116.21,11.38 v1(116.29,11.3)
  Bottom Layer w0.305: v1(116.29,11.3) 116.29,6.51 v1(115.06,5.28)
  Bottom Layer w0.5: v1(14.29,86.94) 8.13,86.94 v1(6.48,88.59) ; v1(29.46,18.76) v1(25.4,18.76) ; v1(76.58,73.61) 79.27,73.61 CON3.1 ; v1(72.01,49.92) v1(72.01,43) ; v1(84.84,65.99) v1(70.66,65.99) 68.45,65.99 66.29,68.15 CON1.1
  Bottom Layer w1: USB2.3 USB2.4 84.33,86.82 USB1.3 USB1.4 61.22,86.82 v1(59.69,85.29) ; U13.3 U13.1 v1(84.71,46.18) ; v1(29.46,85.34) 24.89,85.34 ; v1(29.46,85.34) 29.46,82.37 27.94,80.85 v1(27.94,80) 17.1,80 v1(17.02,80.09) ; v1(29.46,85.34) 37.92,85.34 v1(38.23,85.04) ; v1(101.6,32.21) 122.81,32.21 127.99,37.39 v1(132.33,37.39) ; v1(79.76,4.71) 63.06,4.71 59.69,1.34 39.75,1.34 36.36,4.74 v1(36.36,9.9)
  vias: v1(0.89,69.54) v1(0.89,68.54) v1(0.89,67.54) v1(0.89,66.54) v1(0.89,65.54) v1(0.89,64.54) v1(0.89,63.54) v1(0.89,62.54) v1(0.89,61.54) v1(0.89,60.54) v1(0.89,59.54) v1(1.89,69.54) v1(1.89,68.54) v1(1.89,67.54) v1(1.89,66.54) v1(1.89,65.54) v1(1.89,64.54) v1(1.89,63.54) v1(1.89,62.54) v1(1.89,61.54) v1(1.89,60.54) v1(1.89,59.54) v1(2.89,69.54) v1(2.89,68.54) v1(2.89,67.54) v1(2.89,66.54) v1(2.89,65.54) v1(2.89,64.54) v1(2.89,63.54) v1(2.89,62.54) v1(2.89,61.54) v1(2.89,60.54) v1(2.89,59.54) v1(3.89,69.54) v1(3.89,68.54) v1(3.89,67.54) v1(3.89,66.54) v1(3.89,65.54) v1(3.89,64.54) v1(3.89,63.54) v1(3.89,62.54) v1(3.89,61.54) v1(3.89,60.54) v1(3.89,59.54) v1(4.89,69.54) v1(4.89,68.54) v1(4.89,67.54) v1(4.89,66.54) v1(4.89,65.54) v1(4.89,64.54) v1(4.89,63.54) v1(4.89,62.54) v1(4.89,61.54) v1(4.89,60.54) v1(4.89,59.54) v1(5.89,69.54) v1(5.89,68.54) v1(5.89,67.54) v1(5.89,66.54) v1(5.89,65.54) v1(5.89,64.54) v1(5.89,63.54) v1(5.89,62.54) v1(5.89,61.54) v1(5.89,60.54) v1(5.89,59.54) v1(6.89,69.54) v1(6.89,68.54) v1(6.89,67.54) v1(6.89,66.54) v1(6.89,65.54) v1(6.89,64.54) v1(6.89,63.54) v1(6.89,62.54) v1(6.89,61.54) v1(6.89,60.54) v1(6.89,59.54) v1(7.89,69.54) v1(7.89,68.54) v1(7.89,67.54) v1(7.89,66.54) v1(7.89,65.54) v1(7.89,64.54) v1(7.89,63.54) v1(7.89,62.54) v1(7.89,61.54) v1(7.89,60.54) v1(7.89,59.54) v1(8.89,69.54) v1(8.89,68.54) v1(8.89,67.54) v1(8.89,66.54) v1(8.89,65.54) v1(8.89,64.54) v1(8.89,63.54) v1(8.89,62.54) v1(8.89,61.54) v1(8.89,60.54) v1(8.89,59.54) v1(10.16,59.77) v1(11.09,59.77) v1(11.94,60.02) v1(14.35,73.61) v1(14.35,72.85) v1(18.42,73.1) v1(18.53,44.25) v1(22.86,30.43) v1(23.37,28.14) v1(29.46,19.76) v1(29.46,17.76) v1(29.46,16.76) v1(29.46,15.76) v1(29.46,14.76) v1(30.46,19.76) v1(30.46,18.76) v1(30.46,17.76) v1(30.46,16.76) v1(30.46,15.76) v1(30.46,14.76) v1(31.46,19.76) v1(31.46,18.76) v1(31.46,17.76) v1(31.46,16.76) v1(31.46,15.76) v1(31.46,14.76) v1(31.75,11.76) v1(32.46,19.76) v1(32.46,18.76) v1(32.46,17.76) v1(32.46,16.76) v1(32.46,15.76) v1(32.46,14.76) v1(33.46,19.76) v1(33.46,18.76) v1(33.46,17.76) v1(33.46,16.76) v1(33.46,15.76) v1(33.46,14.76) v1(33.66,11.35) v1(33.91,6.55) v1(34.46,19.76) v1(34.46,18.76) v1(34.46,17.76) v1(34.46,16.76) v1(34.46,15.76) v1(34.46,14.76) v1(35.81,14.17) v1(42.19,70.39) v1(42.19,69.39) v1(43.19,70.39) v1(44.19,70.39) v1(44.19,69.39) v1(46.95,85.04) v1(48.64,56.72) v1(52.96,69.93) v1(52.96,68.93) v1(52.96,67.93) v1(52.96,66.93) v1(52.96,65.93) v1(53.96,69.93) v1(53.96,68.93) v1(53.96,67.93) v1(53.96,66.93) v1(53.96,65.93) v1(54.96,69.93) v1(54.96,68.93) v1(54.96,67.93) v1(54.96,66.93) v1(54.96,65.93) v1(61.1,57.86) v1(68.58,62.18) v1(71.5,60.27) v1(73.03,57.61) v1(75.69,18.62) v1(76.84,30.68) v1(81.15,35.76) v1(81.91,3) v1(83.57,6.17) v1(83.95,28.9) v1(103.5,1.6) v1(108.41,12.01) v1(110.87,12.01) v1(111.12,29.67) v1(111.51,33.86) v1(111.5,7.45) v1(112.38,7.45) v1(117.15,71.12) v1(117.15,56.46) v1(118.36,68.4) v1(122.43,71.07) v1(122.94,68.78) v1(124.23,56.46) v1(125.86,30.56) v1(125.86,27.25) v1(127.76,39.06) v1(128.4,56.46) v1(131.06,70.69) v1(131.7,59.51) v1(131.95,54.43) v1(132.72,36.4) v1(141.1,53.8) v1(141.22,57.61) v1(145.29,36.14) v1(146.3,68.91) v1(148.84,43.13)
PGND: length 24.4
  Top Layer w0.5: v1(62.36,16.46) 63.93,16.46 R88.1 ; v1(51.38,14.39) 51.44,14.45 R48.1
  Bottom Layer w0.5: v1(62.36,16.46) 62.36,11.63 60.07,9.35 52.07,9.35 51.38,10.03 v1(51.38,14.39)
PGND_EN: length 17.9
  Top Layer w1: C59.2 v1(67.46,8.03) CN2.2 ; R86.1 v1(74.55,8.08) 74.61,8.14 C58.2
  Bottom Layer w1: v1(67.46,8.03) 74.51,8.03 v1(74.55,8.08)
PGND_IMU: length 6.2
  Bottom Layer w0.508: R19.1 111.09,18.99 R87.2 113.28,19.12 113.43,18.98 115.04,18.98
VCC_BAT:
  vias: v1(42.8,38.68) v1(42.8,37.68) v1(42.8,36.68) v1(42.8,35.68) v1(42.8,34.68) v1(42.8,33.68) v1(43.8,38.68) v1(43.8,37.68) v1(43.8,36.68) v1(43.8,35.68) v1(43.8,34.68) v1(43.8,33.68) v1(44.8,38.68) v1(44.8,37.68) v1(44.8,36.68) v1(44.8,35.68) v1(44.8,34.68) v1(44.8,33.68) v1(45.8,38.68) v1(45.8,37.68) v1(45.8,36.68) v1(45.8,35.68) v1(45.8,34.68) v1(45.8,33.68) v1(46.8,38.68) v1(46.8,37.68) v1(46.8,36.68) v1(46.8,35.68) v1(46.8,34.68) v1(46.8,33.68) v1(47.8,38.68) v1(47.8,37.68) v1(47.8,36.68) v1(47.8,35.68) v1(47.8,34.68) v1(47.8,33.68) v1(55.63,38.68) v1(55.63,37.68) v1(55.63,36.68) v1(55.63,35.68) v1(55.63,34.68) v1(55.63,33.68) v1(56.63,38.68) v1(56.63,37.68) v1(56.63,36.68) v1(56.63,35.68) v1(56.63,34.68) v1(56.63,33.68) v1(57.63,38.68) v1(57.63,37.68) v1(57.63,36.68) v1(57.63,35.68) v1(57.63,34.68) v1(57.63,33.68) v1(58.63,38.68) v1(58.63,37.68) v1(58.63,36.68) v1(58.63,35.68) v1(58.63,34.68) v1(58.63,33.68) v1(59.63,38.68) v1(59.63,37.68) v1(59.63,36.68) v1(59.63,35.68) v1(59.63,34.68) v1(59.63,33.68) v1(60.63,38.68) v1(60.63,37.68) v1(60.63,36.68) v1(60.63,35.68) v1(60.63,34.68) v1(60.63,33.68)
AUX_DA: length 21.3
  Top Layer w0.203: v1(101.09,9.3) 101.09,8.46 101.53,8.02 U9.21 ; U12.16 97.16,4.4 v1(96.3,4.4) R24.2
  Bottom Layer w0.254: 96.27,4.39 96.27,8.03 97.54,9.3 v1(101.09,9.3)
AUX_SCL: length 41.8
  Top Layer w0.203: 97.28,2.35 v1(97.28,3) 97.68,3.39 U12.1 ; v1(117.98,1.09) 120.52,3.63 120.52,6.98 120.32,7.19 118.49,7.19 118,6.7 118,4.79 117.6,4.39 115.06,4.39 114.55,4.9 114.55,5.04 114.53,5.06 114.53,5.5 114.55,5.53 114.55,6.68 114.37,6.87 113.36,6.87 U9.7
  Bottom Layer w0.254: v1(97.28,3) 103.89,3 105.72,1.17 117.91,1.17 v1(117.98,1.09)
BAT_ADC: length 138.2
  Top Layer w0.254: C34.1 v1(15.62,49.48) ; U13.11 110.74,43.26 109.73,42.24 v1(109.73,38.56)
  Top Layer w1: R22.1 R25.2
  Bottom Layer w0.254: v1(109.73,38.56) 104.39,38.56 86.11,20.27 64.26,20.27 62.74,21.79 62.74,30.56 61.59,31.7 31.11,31.7 22.48,40.33 22.48,47.19 20.19,49.48 v1(15.62,49.48)
BEEP: length 10.3
  Top Layer w0.254: R79.1 131.82,42.23 132.33,42.75 132.33,47.45 U13.28
  Top Layer w0.5: R80.1 R79.1
C1_ADC: length 72.3
  Top Layer w0.254: v1(121.41,39.83) 123.44,41.86 U13.21 ; R53.2 65.91,22.68 66.42,22.17 v1(74.68,22.17)
  Bottom Layer w0.254: v1(121.41,39.83) 101.98,39.83 84.33,22.17 v1(74.68,22.17)
DEBUG_RX: length 40.5
  Top Layer w0.254: U15.6 v1(87.76,66.88) ; U13.89 v1(105.66,70.32)
  Bottom Layer w0.254: v1(87.76,66.88) 92.07,66.88 95.52,70.32 v1(105.66,70.32)
DEBUG_TX: length 47.9
  Top Layer w0.254: v1(107.7,67.77) 107.82,67.89 107.82,79.45 109.47,81.1 109.47,85.67 108.33,86.82 U13.88 ; U15.7 v1(89.03,65.99)
  Bottom Layer w0.254: v1(107.7,67.77) 107.57,67.64 96.27,67.64 94.62,65.99 v1(89.03,65.99)
EN1: length 95.4
  Top Layer w0.254: U17.3 44.32,52.4 45.47,53.54 v1(51.82,53.54) ; U13.94 98.81,88.59 97.41,88.59 96.14,87.32 96.14,74.37 93.09,71.32 93.09,57.1 v1(89.53,53.54) ; 57.02,53.54 U19.3 ; 57.02,53.54 v1(58.16,53.54) ; 57.02,53.54 R43.2 ; 57.02,53.54 v1(55.75,53.54)
  Bottom Layer w0.254: v1(51.82,53.54) v1(55.75,53.54) ; v1(58.16,53.54) v1(89.53,53.54)
ENCODER1_A: length 95.5
  Top Layer w0.254: v1(96.6,11.56) v1(96.6,21.16) ; U13.25 128.52,44.14 121.23,36.85 v1(121.23,21.21)
  Top Layer w0.5: 73.15,12.4 v1(73.15,11.56) 73.15,3.56 CN2.4
  Bottom Layer w0.254: v1(121.23,21.21) 121.18,21.16 v1(96.6,21.16) ; v1(96.6,11.56) v1(73.15,11.56)
ENCODER1_B: length 99.9
  Top Layer w0.254: U13.24 125.73,48.72 124.84,47.83 124.84,41.86 120.27,37.29 v1(120.27,22.71) ; v1(95.38,22.05) 95.38,10.79 v1(94.98,10.4)
  Top Layer w0.5: 70.23,12.4 v1(70.23,10.4) 70.23,3.14 CN2.3
  Bottom Layer w0.254: v1(95.38,22.05) 119.6,22.05 v1(120.27,22.71) ; v1(94.98,10.4) v1(70.23,10.4)
HEAT_PWM: length 82.1
  Top Layer w0.254: v1(98.93,18.49) 98.93,25.09 102.87,29.03 102.87,34.11 101.85,35.13 101.85,53.03 104.27,55.45 104.27,78.05 U13.97
  Bottom Layer w0.254: v1(98.93,18.49) 98.93,16.84 100.16,15.62 R17.1
IMU_3.3V: length 87.9
  Top Layer w0.203: C32.2 113.35,10.81 112.89,10.35 U9.13 ; U12.2 98.18,2.48 98.87,1.79 99.82,1.79 ; U9.8 114.52,7.22 114.94,6.81 116.02,6.81 C29.1 ; 99.82,1.79 C35.2 ; 99.82,1.79 99.82,0.96 99.57,0.71 96.39,0.71 95.78,1.33 95.78,2.35 94.75,3.38 93.38,3.38
  Top Layer w0.305: 118.62,8.98 118.62,9.47 117.47,10.62 117.47,11.89 116.46,12.9 113.73,12.9 113.35,12.52 C32.2 ; 118.62,8.98 118.62,8.46 116.91,6.74 C29.1 ; 118.62,8.98 120.03,8.98 121.79,10.74 121.79,13.66 119,16.46 v1(106.93,16.46) ; v1(98.04,19.51) 98.04,11.12 95.25,8.33 R24.1
  Top Layer w1: U7.4 90.78,4.22 C23.2 93.19,3.57 ; R24.1 95.03,6.13 LED6.2 93.22,5.88 C22.2
  Bottom Layer w0.305: v1(106.93,16.46) 106.3,16.46 103.25,19.51 v1(98.04,19.51)
  vias: v1(86.87,7.31) v1(86.87,6.3) v1(88.52,6.3) v1(88.57,7.31) v1(90.04,7.31) v1(90.01,6.3)
IMU_INT: length 103.9
  Top Layer w0.203: U9.12 113.79,8.82 113.94,8.97 113.94,9.71 v1(113.64,10.01) ; v1(109.08,9.98) 109.01,10.05 107.51,10.05 106.68,9.22 104.52,9.22 103.12,10.62 103.12,15.31 108.71,20.9 113.54,20.9 114.55,21.92 v1(114.55,27)
  Top Layer w0.254: U13.70 129.79,85.55 129.79,72.97 119.63,62.81 119.63,41.73 119.25,41.35 119.25,31.7 v1(114.55,27)
  Bottom Layer w0.203: v1(113.64,10.01) 109.11,10.01 v1(109.08,9.98)
IN1_1: length 12.9
  Top Layer w0.254: 66.41,48.46 65.41,48.46 64.9,48.97 v1(64.9,50.62) ; U19.1 v1(59.56,50.62)
  Top Layer w0.5: 66.36,48.53 66.42,48.6 ; 66.43,48.46 U21.1
  Bottom Layer w0.254: v1(59.56,50.62) v1(64.9,50.62)
IN1_2: length 48.8
  Top Layer w0.254: v1(46.99,52.53) 46.86,52.4 U17.1 ; U21.7 79.37,47.19 R54.1 80.76,47.2 ; v1(80.7,52.65) 80.7,47.27 80.76,47.2 ; v1(80.77,47.19) 80.76,47.2
  Bottom Layer w0.254: v1(80.7,52.65) 47.12,52.65 v1(46.99,52.53)
KEY1: length 41.4
  Top Layer w0.254: SW1.2 v1(134.75,74.12)
  Bottom Layer w0.254: v1(134.75,74.12) U13.49
KEY2: length 41.5
  Top Layer w0.254: v1(137.41,71.96) 137.41,44.91 138.81,43.51 SW2.2
  Bottom Layer w0.254: v1(137.41,71.96) 145.8,71.96 146.3,72.47 U13.50
KEY3: length 65.1
  Top Layer w0.254: v1(122.17,82.75) 122.17,85.55 U13.78 ; v1(139.95,82.63) 139.95,44.4 141.22,43.13 142.07,43.13 142.75,42.45 SW3.2
  Bottom Layer w0.254: v1(139.95,82.63) 139.83,82.75 v1(122.17,82.75)
KEY4: length 69.1
  Top Layer w0.254: SW4.2 146.78,43.23 148.21,44.65 148.21,61.04 147.19,62.05 145.67,62.05 141.1,66.62 v1(141.1,81.48)
  Bottom Layer w0.254: v1(141.1,81.48) 140.84,81.74 119.25,81.74 118.36,82.63 U13.79
LED0: length 27.5
  Top Layer w0.254: v1(117.09,50.24) 117.09,42.87 116.21,41.99 LED8.1
  Bottom Layer w0.254: v1(117.09,50.24) 132.08,50.24 U13.30
M1_CURRENT: length 34.5
  Top Layer w0.254: R61.1 74.68,26.24 76.45,24.46 76.45,22.81 74.29,20.65 64.01,20.65 62.36,19 53.72,19 52.96,19.76 v1(52.96,21.72)
  Top Layer w0.5: v1(52.96,21.72) v1(52.96,22.43)
MCU_IN1_1: length 91.5
  Top Layer w0.254: v1(66.04,41.1) 65.41,41.73 65.41,45.16 66.16,45.91 R58.2 66.81,45.92 U21.3 ; v1(142.49,43.64) 142.49,47.45 U13.38
  Bottom Layer w0.254: v1(142.49,43.64) 139.95,41.1 v1(66.04,41.1)
MCU_IN1_2: length 72.4
  Top Layer w0.254: U21.5 76.57,44.65 R60.2 v1(77.98,44.64)
  Bottom Layer w0.254: U13.39 144.77,44.64 v1(77.98,44.64)
MOTOR_5V: length 94.5
  Top Layer w0.5: U5.3 28.83,23.95 26.92,25.86 C15.2 25.82,25.76 LED11.2 ; R3.2 44.08,65.99 44.01,66.06 44.01,67.07 44.83,67.89 47.12,67.89 47.75,68.53 U6.6
  Top Layer w1: C16.1 30.98,5.88 32.72,4.14 39.62,4.14 40.89,5.41 40.89,9.47 37.85,12.52 37.85,40.33 40.13,42.62 40.13,52.27 44.32,56.46 44.32,65.98 R3.2
SERVO_6V35: length 50.3
  Top Layer w0.254: R81.2 26.8,67.13 30.99,71.32 30.99,72.08 31.32,72.41 C65.2
  Top Layer w1: C65.2 32.35,79.55 C68.2 ; L4.1 37.21,73.99 40.77,77.55 40.77,81.23 42.74,83.21 52.07,83.21 53.72,84.86 U24.2
SERVO_PWM: length 115.2
  Top Layer w0.254: U24.1 56.6,86.31 62.1,86.31 64.52,83.9 64.52,79.83 69.47,74.88 77.09,74.88 77.47,74.5 v1(77.47,60.77) ; v1(130.3,43.76) 131.06,44.53 U13.27 ; v1(88.14,43.64) v1(88.14,60.78)
  Bottom Layer w0.254: v1(88.14,60.78) 88.13,60.77 v1(77.47,60.77) ; v1(130.3,43.76) 130.18,43.64 v1(88.14,43.64)
SERVOR_GND: length 58.7
  Top Layer w0.5: R82.1 24.97,59.96 C64.1 23.37,62.05 v1(23.24,62.18) ; U25.6 31.75,59.64 U25.9 ; v1(40,61.29) 38.72,61.29 C61.1 v1(38.59,62.7) 38.35,62.94 v1(37.71,62.94) 32.28,62.94 v1(32.16,62.82)
  Top Layer w1: 35.22,81.54 35.15,81.61 31.5,81.61 30.8,80.91 C68.1 29.97,79.7 29.17,78.9 C65.1 29.17,71.15 v1(28.5,70.49) ; 35.22,81.54 R85.1 ; 35.22,81.54 35.22,84.45 37.47,86.69 U24.3 ; D8.1 31.98,69.42 v1(30.61,69.42) ; C62.1 v1(38.59,59.93) C61.1
  vias: v1(30.16,62.82) v1(30.16,61.82) v1(30.16,60.82) v1(30.16,59.82) v1(30.16,58.82) v1(30.16,57.82) v1(31.16,62.82) v1(31.16,61.82) v1(31.16,60.82) v1(31.16,59.82) v1(31.16,58.82) v1(31.16,57.82) v1(32.16,61.82) v1(32.16,60.82) v1(32.16,59.82) v1(32.16,58.82) v1(32.16,57.82)
SPI_MISO: length 129.7
  Top Layer w0.203: v1(103.11,16.32) 101.73,14.93 101.73,9.17 102.24,8.66 107.24,8.66 v1(107.93,9.35) ; U9.9 v1(114.94,7.62)
  Top Layer w0.254: v1(109.22,78.94) 109.22,58.5 104.39,53.67 104.39,44.02 103,42.62 103,36.78 103.76,36.02 103.76,22.55 99.95,18.74 v1(99.95,18.11)
  Bottom Layer w0.203: v1(114.94,7.62) 114.94,8.71 114.3,9.35 v1(107.93,9.35)
  Bottom Layer w0.254: v1(99.95,18.11) 101.98,18.11 103.12,16.97 103.12,16.33 v1(103.11,16.32) ; U13.55 142.88,81.74 140.08,78.94 v1(109.22,78.94)
SPI_MOSI: length 126.7
  Top Layer w0.203: 100.2,17.22 99.06,16.08 99.06,7.7 99.93,6.82 U9.24
  Top Layer w0.254: v1(110.62,77.8) 110.74,77.67 110.74,56.08 107.06,52.4 107.06,44.27 104.65,41.86 104.65,35.76 104.9,35.51 104.9,27 105.16,26.75 105.16,22.17 100.2,17.22
  Bottom Layer w0.254: U13.57 145.03,83.01 145.03,81.1 144.4,80.47 142.88,80.47 140.21,77.8 v1(110.62,77.8)
SPI_NSS: length 127.9
  Top Layer w0.203: U9.22 100.91,7.62 100.84,7.7
  Top Layer w0.254: v1(112.78,76.78) 112.78,52.02 114.68,50.11 114.68,43.89 v1(115.7,42.87) ; v1(117.86,42.24) 117.86,33.48 112.14,27.76 112.14,22.94 111.12,21.92 107.44,21.92 100.41,14.88 100.41,8.13 100.84,7.7
  Bottom Layer w0.254: U13.56 146.3,80.97 145.03,79.7 145.03,78.69 144.27,77.93 142.49,77.93 141.35,76.78 v1(112.78,76.78) ; v1(115.7,42.87) 117.22,42.87 v1(117.86,42.24)
SPI_SCK: length 123.8
  Top Layer w0.203: U9.23 100.29,7.22 99.69,7.82 99.69,15.19 106.55,22.05 106.55,24.33
  Top Layer w0.254: v1(111.89,75.39) 112.01,75.39 112.14,75.26 112.14,51.89 109.73,49.48 109.73,49.16 109.71,49.14 109.71,48.29 109.73,48.28 109.73,46.62 109.71,46.6 109.71,45.75 109.73,45.74 109.73,45.16 106.55,41.99 106.55,24.33
  Bottom Layer w0.254: U13.54 147.7,77.8 147.7,76.02 147.07,75.39 v1(111.89,75.39)
U1_CC1: length 8.2
  Top Layer w0.254: v1(79.25,84.02) 79.49,84.27 R26.1 ; USB1.A5 73.89,83.37 v1(74.55,84.02)
  Bottom Layer w0.254: v1(74.55,84.02) v1(79.25,84.02)
U1_CC2: length 7.4
  Top Layer w0.254: R28.1 v1(67.06,84.39) ; v1(70.87,84.39) 70.87,83.56 70.89,83.53 USB1.B5
  Bottom Layer w0.254: v1(67.06,84.39) v1(70.87,84.39)
U1_USBD+: length 20.8
  Top Layer w0.254: USB1.A6 72.89,83.72 ; 72.89,83.72 72.85,83.77 72.14,83.77 71.89,83.53 USB1.B6 ; 72.89,83.72 72.89,84.4 73.28,84.78 v1(73.41,84.78) ; v1(78.49,84.78) 78.54,84.73 78.54,80.9 78.36,80.72 74.8,80.72 74.42,80.34 74.42,78.58
  Bottom Layer w0.254: v1(78.49,84.78) v1(73.41,84.78)
U1_USBD-: length 5.4
  Top Layer w0.254: USB1.A7 72.39,80.59 72.64,80.34 73.15,80.34 ; 73.15,80.34 U14.2 ; 73.15,80.34 73.39,80.58 USB1.B7
U2_CC1: length 8.9
  Top Layer w0.254: v1(90.55,84.15) 90.15,83.75 USB2.A5 ; R29.1 v1(94.87,84.4)
  Bottom Layer w0.254: v1(90.55,84.15) 90.81,84.4 v1(94.87,84.4)
U2_CC2: length 8
  Top Layer w0.254: USB2.B5 87.15,84.25 v1(86.49,84.91) ; v1(83.06,84.01) 82.8,84.28 81.92,84.28 R30.1
  Bottom Layer w0.254: v1(83.06,84.01) 83.96,84.91 v1(86.49,84.91)
U2_USBD+: length 20.7
  Top Layer w0.254: 88.15,83.86 88.15,84.8 v1(88.39,85.04) ; 88.15,83.86 USB2.B6 ; 88.15,83.86 88.68,83.86 89.15,83.39 89.15,82.25 USB2.A6 ; 90.3,78.83 90.3,80.59 90.93,81.23 93.22,81.23 93.55,81.56 94.18,81.56 94.36,81.74 94.36,83.64 94.11,83.9 v1(94.11,85.04)
  Bottom Layer w0.254: v1(88.39,85.04) v1(94.11,85.04)
U2_USBD-: length 4.6
  Top Layer w0.254: 89.03,80.85 88.65,81.22 USB2.A7 ; 89.03,80.85 U15.2 ; 89.03,80.85 89.65,81.47 USB2.B7
UP_RX: length 101.1
  Top Layer w0.254: U14.6 v1(71.88,65.23) ; U13.59 145.03,83.01 v1(145.03,65.23)
  Bottom Layer w0.254: v1(145.03,65.23) v1(71.88,65.23)
UP_TX: length 108
  Top Layer w0.254: v1(146.69,64.46) 148.46,66.24 148.46,84.66 U13.58 ; U14.7 v1(73.15,64.46)
  Bottom Layer w0.254: v1(146.69,64.46) 145.03,62.81 97.03,62.81 95.38,64.46 v1(73.15,64.46)
WIFI_3.3V: length 47.4
  Top Layer w0.254: C40.1 9.97,85.67 9.97,84.47 10.41,84.02 10.41,81.74 10.17,81.49 R32.2 9.53,79.96 9.02,79.45 R34.2
  Top Layer w0.5: 5.48,87.32 U16.2
  Top Layer w1: 27.94,83.51 27.94,87.2 26.92,88.21 16.65,88.21 R31.1 16.5,88.09 10.54,88.09 10.09,87.64 10.09,87.33 ; 27.94,83.51 30.23,83.51 30.35,83.64 ; 27.94,83.51 26.73,82.31 C11.2 C12.2 23.75,80 ; 10.09,87.33 C40.1 ; 10.09,87.33 10.07,87.36 U16.2
WIFI_LINK: length 109.6
  Top Layer w0.254: LED10.1 7.36,77.09 6.86,77.6 v1(6.86,78.34) 6.86,79.94 U16.8
  Bottom Layer w0.254: U13.105 100.58,71.7 100.91,72.03 102.31,72.03 102.49,72.21 102.49,74.37 101.47,75.39 97.28,75.39 93.34,79.32 43.18,79.32 41.53,80.97 38.23,80.97 35.94,78.69 7.49,78.69 7.27,78.46 6.98,78.46 v1(6.86,78.34)
WIFI_NRST: length 112.2
  Top Layer w0.254: v1(1.62,71.96) 1.62,80.82 2.16,81.36 U16.7
  Bottom Layer w0.254: v1(1.62,71.96) 1.75,71.83 5.08,71.83 9.27,76.02 38.73,76.02 40.18,77.47 87.96,77.47 93.85,71.58 U13.106
WIFI_READY: length 110.8
  Top Layer w0.254: LED9.1 v1(7.88,77.55)
  Bottom Layer w0.254: U16.9 2.16,78.07 2.16,74.24 2.92,73.48 5.72,73.48 7.94,75.71 7.94,77.48 v1(7.88,77.55) 36.85,77.55 37.74,78.43 92.33,78.43 96.65,74.12 U13.104
WIFI_RX: length 147.4
  Top Layer w0.254: v1(134.37,80.85) 135.89,80.85 136.14,81.1 U13.65
  Bottom Layer w0.254: U16.3 3.06,85.74 1.84,85.74 1.14,86.44 1.14,88.72 1.78,89.36 27.05,89.36 28.58,87.83 41.91,87.83 48.64,81.1 95.76,81.1 96.39,80.47 101.98,80.47 102.36,80.85 v1(134.37,80.85)
WIFI_TX: length 144.9
  Top Layer w0.254: v1(137.29,79.83) 137.41,79.96 137.41,85.55 U13.64
  Bottom Layer w0.254: v1(137.29,79.83) 104.39,79.83 102.48,77.91 97.62,77.91 95.32,80.21 46.74,80.21 39.73,87.22 28.43,87.22 28.33,87.32 23.37,87.32 22.03,85.99 6.33,85.99 5.7,85.36 U16.4
$1N1982: length 7.8
  Top Layer w1: 20.83,65.23 20.83,63.09 D1.1 20.37,62.64 U3.2
$1N4550: length 1.6
  Top Layer w1: R1.2 15.1,79.96 LED1.1
$1N4630: length 1.8
  Top Layer w1: R2.2 17.41,41.02 LED2.1
$1N5512: length 14.2
  Top Layer w0.5: L2.2 60.96,61.16 62.23,62.43 62.23,64.06 62.24,64.07 D2.1 58.69,65.59 58.29,65.99 U6.1
$1N5995: length 2.3
  Top Layer w1: LED4.1 42.8,62.6 R8.2
$1N6062: length 2.8
  Top Layer w0.5: C19.2 58.61,68.72 58.42,68.53 U6.3
$1N6242: length 2.1
  Top Layer w0.5: U6.8 R5.2
$1N9356: length 1.7
  Top Layer w0.5: LED3.1 32.34,85.32 R6.2
$1N9942: length 1.6
  Top Layer w1: LED6.1 93.47,9.35 R10.2
$1N28494: length 2.7
  Top Layer w0.5: R77.2 24.65,22.16 24.22,22.59 LED11.1
$1N33755: length 1.7
  Top Layer w1: 53.6,71.58 R7.2
$1N33784: length 13.8
  Top Layer w0.5: R5.1 47.63,66.89 48.01,67.26 U6.7 ; R5.1 47.62,65.98 45.85,65.98 ; R5.1 47.63,63.06 49.53,61.16 L2.1
$1N39664: length 7.4
  Top Layer w1: C63.1 37.16,65.1 L4.2
$1N40118: length 5.1
  Top Layer w0.254: 28.42,58.37 27.43,58.37 27.3,58.5 R81.1 26.74,58.56 C64.2
$5N4200: length 3.4
  Top Layer w0.203: C31.1 115.76,8.52 115.52,8.28 114.12,8.28 113.86,8.02 U9.10
$5N6459: length 1.9
  Top Layer w0.203: 97.87,7.82 98.12,7.82 98.68,7.27 U12.10
$5N17183: length 21.4
  Top Layer w0.254: SW5.2 20.48,86.75 C69.2 18.61,86.82 17.78,86.82 17.53,86.57 R31.2 v1(16.51,84.02) 16.51,83.9 15.88,83.26 11.68,83.26 10.92,82.5 10.92,81.36 10.41,80.85 v1(10.41,79.32)
  Bottom Layer w0.254: v1(10.41,79.32) 10.38,79.36 U16.10
$5N17688: length 1.7
  Top Layer w1: LED8.2 112.73,41.85 R27.1
$5N17736: length 1.7
  Top Layer w0.254: LED9.2 9.48,83.04 R32.1
$5N17775: length 2.9
  Top Layer w0.254: LED10.2 8.73,74.84 9.02,75.13 R34.1
$5N19499: length 27.7
  Bottom Layer w0.508: R13.1 109.6,6.98 109.6,4.77 109.85,4.52 R12.1 110.83,4.27 114.35,4.27 114.58,4.03 117.12,4.03 117.47,4.39 117.47,5.66 121.41,9.6 121.41,14.43 117.81,18.03 Q1.3
$5N19504: length 4
  Bottom Layer w0.508: R17.2 R19.2 114.98,17.14 Q1.1
$5N33679: length 3.4
  Top Layer w0.5: R78.2 116.22,37.54 BUZZER1.1
$5N33846: length 2
  Top Layer w0.5: R79.2 130.81,38.85 Q10.1
$5N33850: length 9.1
  Top Layer w0.5: Q10.3 129.79,35.76 129.16,35.13 124.46,35.13 123.94,35.65 BUZZER1.2
$6N266: length 43.6
  Top Layer w0.5: U19.6 57.02,40.97 56.26,40.21 54.36,40.21 53.59,39.45 53.59,27.38 55.63,25.35 59.18,25.35 60.32,26.49 60.32,29.16 60.83,29.16 ; C45.1 63.25,29.92 62.48,29.16 v1(60.83,29.16)
  vias: v1(59.94,30.17) v1(59.94,29.16) v1(59.94,28.14) v1(60.83,30.17) v1(60.83,28.14) v2(55.5,17.22) v2(55.5,15.95) v2(55.5,14.68) v2(55.5,13.41) v2(55.5,12.14) v2(56.77,17.22) v2(56.77,15.95) v2(56.77,14.68) v2(56.77,13.41) v2(56.77,12.14) v2(58.04,17.22) v2(58.04,15.95) v2(58.04,14.68) v2(58.04,13.41) v2(58.04,12.14) v2(59.31,17.22) v2(59.31,15.95) v2(59.31,14.68) v2(59.31,13.41) v2(59.31,12.14) v2(60.58,17.22) v2(60.58,15.95) v2(60.58,14.68) v2(60.58,13.41) v2(60.58,12.14)
$6N267: length 43
  Top Layer w0.5: C43.1 50.8,29.79 50.04,29.03 v1(47.88,29.03) ; 47.5,29.16 47.5,25.86 46.99,25.35 42.67,25.35 40.89,27.13 40.89,38.68 44.32,42.11 U17.6
  vias: v1(46.99,30.05) v1(46.99,29.03) v1(46.99,28.02) v1(47.88,30.05) v1(47.88,28.02) v2(42.67,17.35) v2(42.67,16.08) v2(42.67,14.81) v2(42.67,13.54) v2(42.67,12.27) v2(43.94,17.35) v2(43.94,16.08) v2(43.94,14.81) v2(43.94,13.54) v2(43.94,12.27) v2(45.21,17.35) v2(45.21,16.08) v2(45.21,14.81) v2(45.21,13.54) v2(45.21,12.27) v2(46.48,17.35) v2(46.48,16.08) v2(46.48,14.81) v2(46.48,13.54) v2(46.48,12.27) v2(47.75,17.35) v2(47.75,16.08) v2(47.75,14.81) v2(47.75,13.54) v2(47.75,12.27)
$6N4714: length 23.1
  Top Layer w0.5: R37.1 58.43,27.01 58.8,27.38 58.8,31.32 59.57,32.09 61.48,32.09 62.23,32.84 62.23,39.45 60.58,41.1 59.06,41.1 58.29,41.86 U19.7
$6N4737: length 26.2
  Top Layer w0.5: U19.5 55.75,41.99 54.86,41.1 53.59,41.1 52.45,39.95 52.45,26.36 54.86,23.95 58.03,23.95 R45.1
$6N4742: length 2.6
  Top Layer w1: Q6.1 59.55,22.44 R45.2
$6N4785: length 9.2
  Top Layer w0.5: 63.35,44.09 D6.2 63.25,43.99 C45.2 ; 63.35,44.09 63.35,45.31 62.74,45.92 60.2,45.92 59.56,45.29 U19.8 ; 63.35,44.09 63.35,43.99
$6N4944: length 2.6
  Top Layer w1: Q7.1 46.72,22.44 R39.1
$6N4973: length 23
  Top Layer w0.5: U17.7 45.59,41.6 46.74,40.46 47.88,40.46 49.15,39.19 49.15,32.45 48.65,31.95 46.48,31.95 45.97,31.44 45.97,27.13 45.6,26.75 R35.2
$6N4991: length 25.5
  Top Layer w0.5: R39.2 41.92,23.94 39.75,26.11 39.75,39.06 43.05,42.37 U17.5
$6N5044: length 9.7
  Top Layer w0.5: C43.2 50.8,43.99 D4.2 50.81,45.66 50.42,46.05 47.37,46.05 46.86,45.54 U17.8
$6N7958: length 5.5
  Top Layer w0.5: U22.3 70.49,28.14 70.87,27.76 70.87,24.52 C52.2
$6N7962: length 5.2
  Top Layer w0.5: R62.1 R56.1 69.22,26.36 U22.2
$6N8007: length 5.5
  Top Layer w0.5: U22.1 67.94,26.36 R56.2 67.82,26.23 R53.1
$6N8497: length 14.4
  Top Layer w0.5: U21.2 71.75,47.19 73.03,45.92 U21.6 77.6,45.92 77.85,45.67 79.37,45.67 R57.2 81.03,45.66 R51.1 81.16,44.09 C51.2

## Copper pours and planes (outline as drawn; the poured copper is in the pictures)
3.3V on Top Layer: 5.33,43.26 13.72,43.26 13.72,36.91 5.33,36.91
5V on Top Layer: 9.14,73.99 23.35,73.99 23.35,69.93 9.14,69.93
12V on Top Layer: 13.74,61.54 30.35,61.54 30.35,51.74 13.74,51.74
12V on Bottom Layer: 3.3,56.01 25.76,56.01 25.76,52.51 3.3,52.51
AGND on Top Layer: 65.02,38.81 64.13,37.92 64.13,23.15 64.52,22.76 73.36,22.76 73.66,23.06 73.66,37.67 72.52,38.81
AGND on Bottom Layer: 65.02,38.81 64.13,37.92 64.13,23.15 64.52,22.76 73.36,22.76 73.66,23.06 73.66,37.67 72.52,38.81
GND on Top Layer: 52.58,70.29 55.37,70.29 55.37,65.48 52.58,65.48
GND on Top Layer: 0.38,70.05 13.59,70.05 13.59,51.51 0.38,51.51
GND on Top Layer: 66.29,44.91 81.66,44.91 81.66,41.86 66.29,41.86
